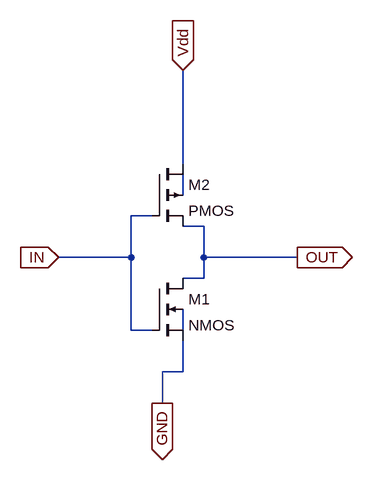
[diagram p0: schematic CMOS_INV.asc]
CMOS_INV.asc, the LTspice schematic file:
Version 4
SHEET 1 1000 684
WIRE 432 208 432 64
WIRE 432 256 432 224
WIRE 384 288 352 288
WIRE 464 304 432 304
WIRE 352 352 352 288
WIRE 352 352 240 352
WIRE 464 352 464 304
WIRE 608 352 464 352
WIRE 464 384 464 352
WIRE 464 384 432 384
WIRE 352 464 352 352
WIRE 384 464 352 464
WIRE 432 464 432 432
WIRE 432 528 432 480
WIRE 432 528 400 528
WIRE 400 576 400 528
FLAG 400 576 GND
IOPIN 400 576 Out
FLAG 432 64 Vdd
IOPIN 432 64 In
FLAG 240 352 IN
IOPIN 240 352 In
FLAG 608 352 OUT
IOPIN 608 352 Out
SYMBOL nmos4 384 384 R0
SYMATTR InstName M1
SYMATTR Value2 l=50n w=500n
SYMBOL pmos4 384 208 R0
SYMATTR InstName M2
SYMATTR Value2 l=50n w=1u

The netlist it stands for:
* CMOS_INV.asc
M1 OUT IN GND N002 NMOS l=50n w=500n
M2 Vdd IN OUT N001 PMOS l=50n w=1u
.model NMOS NMOS
.model PMOS PMOS
.lib standard.mos
.backanno
.end